# EAGLE schematic Arm_Board_2018 (EAGLE 8.4.1)

## Sheet 1 of 4: Tiva C TM4C1294NCPDT
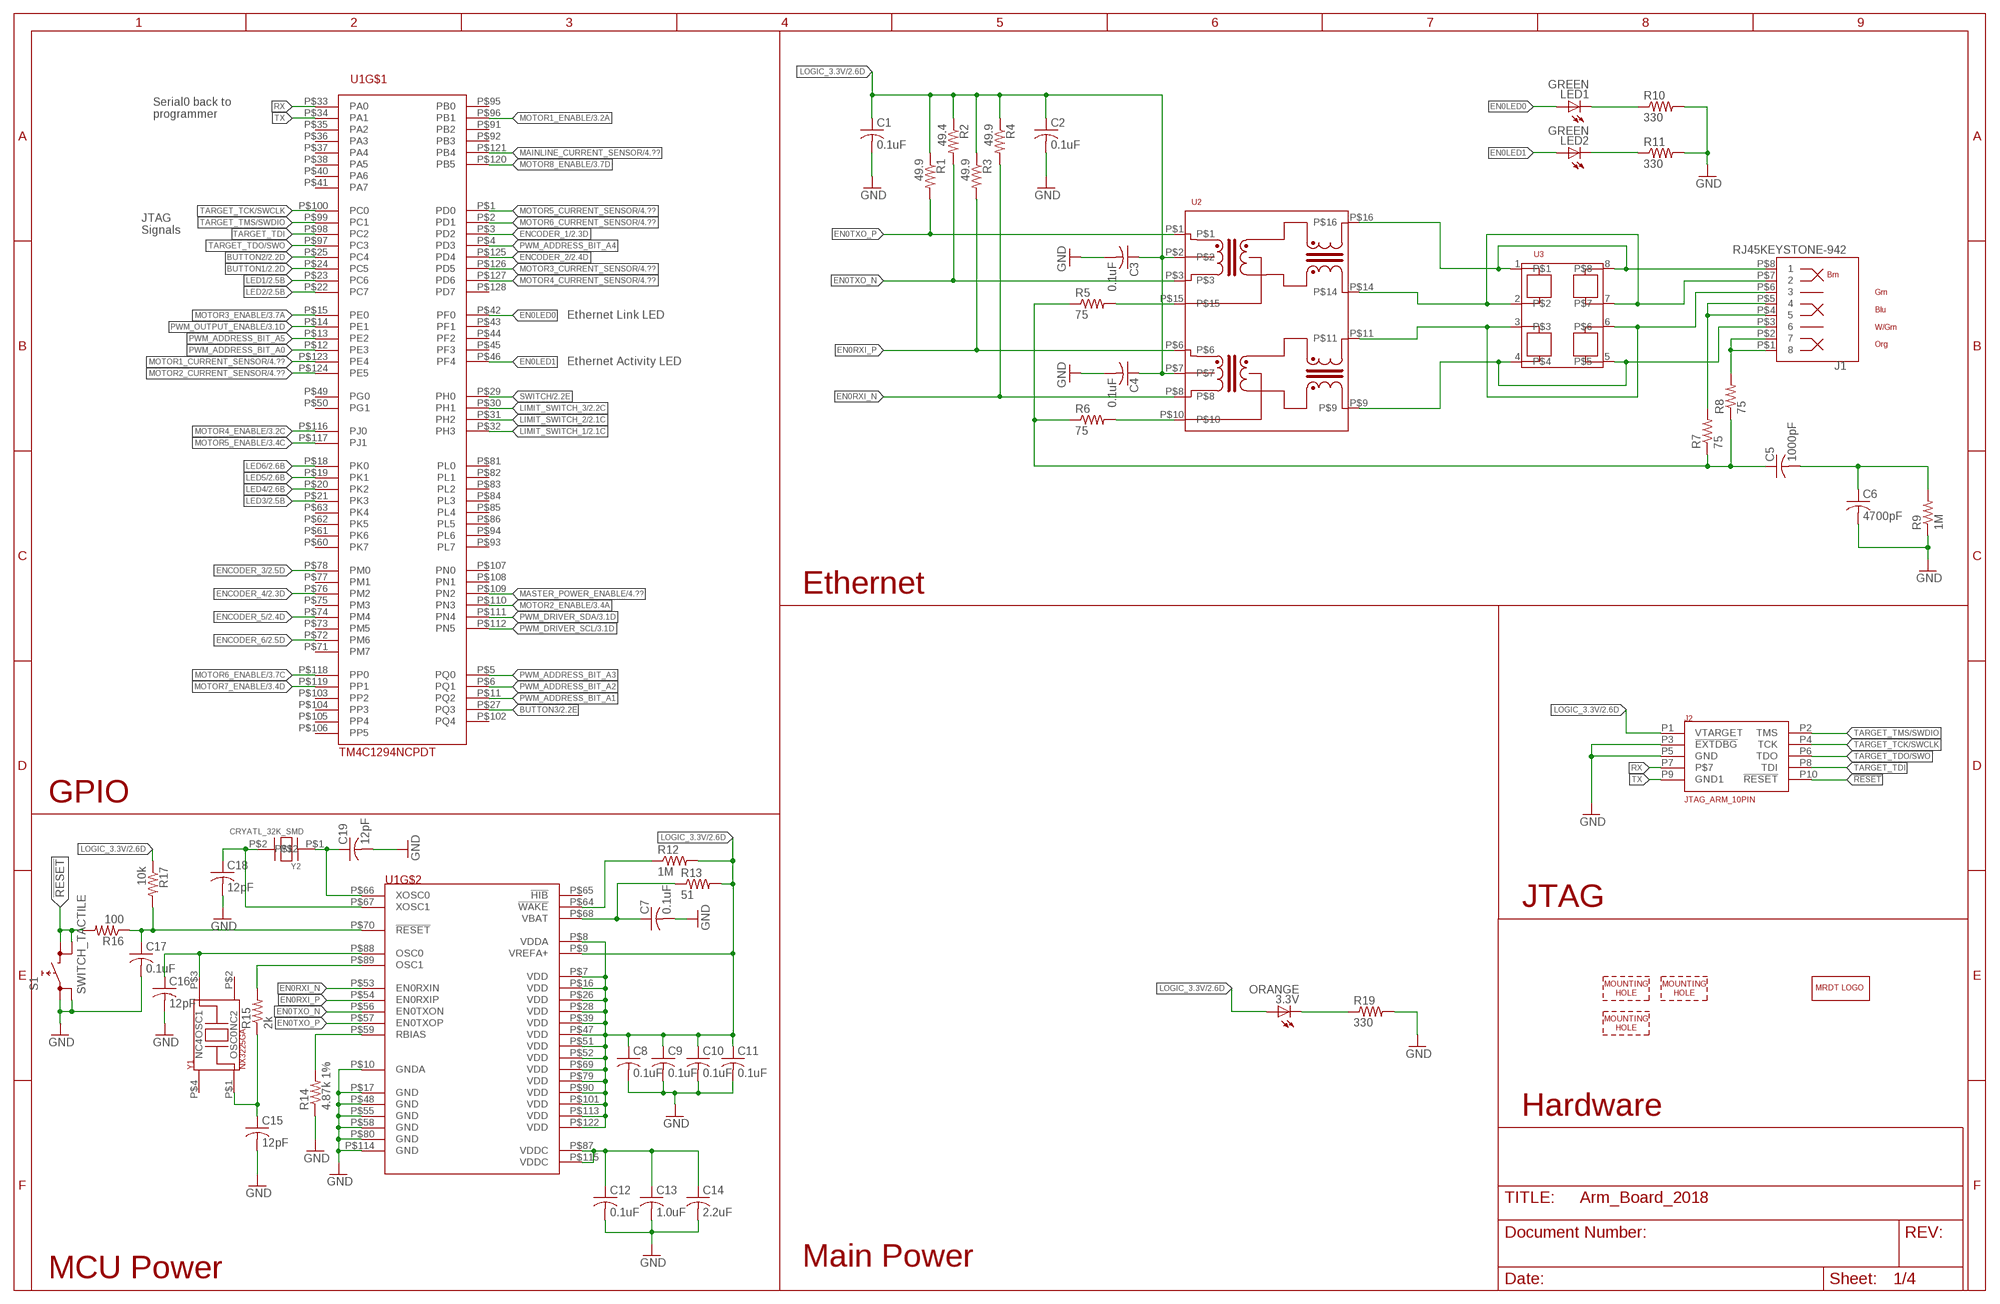
[diagram p0: schematic, sheet 1]

### Parts
3.3V  ORANGE  LEDCHIP-LED0603  [CHIP-LED0603]
C1  0.1uF  C-USC0603  [C0603]
C2  0.1uF  C-USC0603  [C0603]
C3  0.1uF  C-USC0603  [C0603]
C4  0.1uF  C-USC0603  [C0603]
C5  1000pF  C-USC0603  [C0603]
C6  4700pF  C-USC1206  [C1206]
C7  0.1uF  C-USC0603  [C0603]
C8  0.1uF  C-USC0603  [C0603]
C9  0.1uF  C-USC0603  [C0603]
C10  0.1uF  C-USC0603  [C0603]
C11  0.1uF  C-USC0603  [C0603]
C12  0.1uF  C-USC0603  [C0603]
C13  1.0uF  C-USC0603  [C0603]
C14  2.2uF  C-USC0603  [C0603]
C15  12pF  C-USC0603  [C0603]
C16  12pF  C-USC0603  [C0603]
C17  0.1uF  C-USC0603  [C0603]
C18  12pF  C-USC0603  [C0603]
C19  12pF  C-USC0603  [C0603]
J1  RJ45KEYSTONE-942  [KEYSTONE-942]
J2  JTAG_ARM_10PIN  [CON_2X5_50MIL]
LED1  GREEN  LEDCHIP-LED0603  [CHIP-LED0603]
LED2  GREEN  LEDCHIP-LED0603  [CHIP-LED0603]
R1  49.9  R-US_R0603  [R0603]
R2  49.4  R-US_R0603  [R0603]
R3  49.9  R-US_R0603  [R0603]
R4  49.9  R-US_R0603  [R0603]
R5  75  R-US_R0603  [R0603]
R6  75  R-US_R0603  [R0603]
R7  75  R-US_R0603  [R0603]
R8  75  R-US_R0603  [R0603]
R9  1M  R-US_R1206  [R1206]
R10  330  R-US_R0603  [R0603]
R11  330  R-US_R0603  [R0603]
R12  1M  R-US_R0603  [R0603]
R13  51  R-US_R0603  [R0603]
R14  4.87k 1%  R-US_R0603  [R0603]
R15  2k  R-US_R0603  [R0603]
R16  100  R-US_R0603  [R0603]
R17  10k  R-US_R0603  [R0603]
R19  330  R-US_R0603  [R0603]
S1  SWITCH_TACTILE  [SWITCH_6MM_6MM_TE_CON_SMD]
U1  TM4C1294NCPDT  [TQFP-128]
U2  HX1198FNL  [HX1198FNL]
U3  SLVU2.8-4  [SOIC8]
U$1  MRDT_LOGO  [MRDT_LOGO]
U$2  MOUNTING_HOLE#6  [#6_SCREW]
U$3  MOUNTING_HOLE#6  [#6_SCREW]
U$4  MOUNTING_HOLE#6  [#6_SCREW]
Y1  NX3225GA  [NDK3.2X2.5]
Y2  CRYATL_32K_SMD  [CRYSTAL_32K_SMD]

### Nets
!RESET: J2.P10(!RESET) R16.2 S1.P$3 S1.P$4
BUTTON1: U1.P$24(PC5) ; also sheet 2
BUTTON2: U1.P$25(PC4) ; also sheet 2
BUTTON3: U1.P$27(PQ3) ; also sheet 2
EN0LED0: LED1.A U1.P$42(PF0)
EN0LED1: LED2.A U1.P$46(PF4)
EN0RXI_N [Ethernet]: R4.2 U1.P$53(EN0RXIN) U2.P$8
EN0RXI_P [Ethernet]: R3.2 U1.P$54(EN0RXIP) U2.P$6
EN0TXO_N [Ethernet]: R2.2 U1.P$56(EN0TXON) U2.P$3
EN0TXO_P [Ethernet]: R1.2 U1.P$57(EN0TXOP) U2.P$1
ENCODER_1: U1.P$3(PD2) ; also sheet 2
ENCODER_2: U1.P$125(PD4) ; also sheet 2
ENCODER_3: U1.P$78(PM0) ; also sheet 2
ENCODER_4: U1.P$76(PM2) ; also sheet 2
ENCODER_5: U1.P$74(PM4) ; also sheet 2
ENCODER_6: U1.P$72(PM6) ; also sheet 2
GND: C1.2 C2.2 C3.2 C4.2 C6.2 C7.2 C8.2 C9.2 C10.2 C11.2 C12.2 C13.2 C14.2 C15.2 C16.2 C17.2 C18.2 C19.2 J2.P3(!EXTDBG) J2.P5(GND) R9.1 R10.2 R11.2 R14.1 R19.2 S1.P$1 S1.P$2 U1.P$10(GNDA) U1.P$17(GND) U1.P$48(GND) U1.P$55(GND) U1.P$58(GND) U1.P$80(GND) U1.P$114(GND) ; also sheet 2,3,4
LED1: U1.P$23(PC6) ; also sheet 2
LED2: U1.P$22(PC7) ; also sheet 2
LED3: U1.P$21(PK3) ; also sheet 2
LED4: U1.P$20(PK2) ; also sheet 2
LED5: U1.P$19(PK1) ; also sheet 2
LED6: U1.P$18(PK0) ; also sheet 2
LIMIT_SWITCH_1: U1.P$32(PH3) ; also sheet 2
LIMIT_SWITCH_2: U1.P$31(PH2) ; also sheet 2
LIMIT_SWITCH_3: U1.P$30(PH1) ; also sheet 2
LOGIC_3.3V: 3.3V.A C1.1 C2.1 C3.1 C4.1 C8.1 C9.1 C10.1 C11.1 J2.P1(VTARGET) R1.1 R2.1 R3.1 R4.1 R12.2 R13.2 R17.1 U1.P$7(VDD) U1.P$8(VDDA) U1.P$9(VREFA+) U1.P$16(VDD) U1.P$26(VDD) U1.P$28(VDD) U1.P$39(VDD) U1.P$47(VDD) U1.P$51(VDD) U1.P$52(VDD) U1.P$69(VDD) U1.P$79(VDD) U1.P$90(VDD) U1.P$101(VDD) U1.P$113(VDD) U1.P$122(VDD) U2.P$2 U2.P$7 ; also sheet 2,3,4
MAINLINE_CURRENT_SENSOR: U1.P$121(PB4) ; also sheet 4
MASTER_POWER_ENABLE: U1.P$109(PN2) ; also sheet 4
MOTOR1_CURRENT_SENSOR: U1.P$123(PE4) ; also sheet 4
MOTOR1_ENABLE: U1.P$96(PB1) ; also sheet 3
MOTOR2_CURRENT_SENSOR: U1.P$124(PE5) ; also sheet 4
MOTOR2_ENABLE: U1.P$110(PN3) ; also sheet 3
MOTOR3_CURRENT_SENSOR: U1.P$126(PD5) ; also sheet 4
MOTOR3_ENABLE: U1.P$15(PE0) ; also sheet 3
MOTOR4_CURRENT_SENSOR: U1.P$127(PD6) ; also sheet 4
MOTOR4_ENABLE: U1.P$116(PJ0) ; also sheet 3
MOTOR5_CURRENT_SENSOR: U1.P$1(PD0) ; also sheet 4
MOTOR5_ENABLE: U1.P$117(PJ1) ; also sheet 3
MOTOR6_CURRENT_SENSOR: U1.P$2(PD1) ; also sheet 4
MOTOR6_ENABLE: U1.P$118(PP0) ; also sheet 3
MOTOR7_ENABLE: U1.P$119(PP1) ; also sheet 3
MOTOR8_ENABLE: U1.P$120(PB5) ; also sheet 3
N_$1: R5.2 U2.P$15
N_$3: R6.2 U2.P$10
N_$4: J1.P$7 U2.P$14 U3.2 U3.7
N_$5: J1.P$6 U2.P$11 U3.3 U3.6
N_$6: J1.P$8 U2.P$16 U3.1 U3.8
N_$7: J1.P$3 U2.P$9 U3.4 U3.5
N_$8: LED2.C R11.1
N_$9: LED1.C R10.1
N_$10: C7.1 R13.1 U1.P$68(VBAT)
N_$11: J1.P$4 J1.P$5 R7.2
N_$12: R12.1 U1.P$64(!WAKE)
N_$13: J1.P$1 J1.P$2 R8.2
N_$14: C5.1 R5.1 R6.1 R7.1 R8.1
N_$15: C5.2 C6.1 R9.2
N_$16: C12.1 C13.1 C14.1 U1.P$87(VDDC) U1.P$115(VDDC)
N_$17: R15.2 U1.P$89(OSC1)
N_$18: C16.1 U1.P$88(OSC0) Y1.P$3(OSC1)
N_$19: R14.2 U1.P$59(RBIAS)
N_$20: C17.1 R16.1 R17.2 U1.P$70(!RESET)
N_$21: C15.1 R15.1 Y1.P$1(OSC0)
N_$22: C18.1 U1.P$67(XOSC1) Y2.P$2
N_$23: C19.1 U1.P$66(XOSC0) Y2.P$1
N_$26: 3.3V.C R19.1
PWM_ADDRESS_BIT_A0: U1.P$12(PE3)
PWM_ADDRESS_BIT_A1: U1.P$11(PQ2)
PWM_ADDRESS_BIT_A2: U1.P$6(PQ1)
PWM_ADDRESS_BIT_A3: U1.P$5(PQ0)
PWM_ADDRESS_BIT_A4: U1.P$4(PD3)
PWM_ADDRESS_BIT_A5: U1.P$13(PE2)
PWM_DRIVER_SCL: U1.P$112(PN5) ; also sheet 3
PWM_DRIVER_SDA: U1.P$111(PN4) ; also sheet 3
PWM_OUTPUT_ENABLE: U1.P$14(PE1) ; also sheet 3
RX: J2.P7 U1.P$33(PA0)
SWITCH: U1.P$29(PH0) ; also sheet 2
TARGET_TCK/SWCLK: J2.P4(TCK) U1.P$100(PC0)
TARGET_TDI: J2.P8(TDI) U1.P$98(PC2)
TARGET_TDO/SWO: J2.P6(TDO) U1.P$97(PC3)
TARGET_TMS/SWDIO: J2.P2(TMS) U1.P$99(PC1)
TX: J2.P9(GND1) U1.P$34(PA1)
Unconnected: U1.P$35(PA2) U1.P$36(PA3) U1.P$37(PA4) U1.P$38(PA5) U1.P$40(PA6) U1.P$41(PA7) U1.P$43(PF1) U1.P$44(PF2) U1.P$45(PF3) U1.P$49(PG0) U1.P$50(PG1) U1.P$60(PK7) U1.P$61(PK6) U1.P$62(PK5) U1.P$63(PK4) U1.P$65(!HIB) U1.P$71(PM7) U1.P$73(PM5) U1.P$75(PM3) U1.P$77(PM1) U1.P$81(PL0) U1.P$82(PL1) U1.P$83(PL2) U1.P$84(PL3) U1.P$85(PL4) U1.P$86(PL5) U1.P$91(PB2) U1.P$92(PB3) U1.P$93(PL7) U1.P$94(PL6) U1.P$95(PB0) U1.P$102(PQ4) U1.P$103(PP2) U1.P$104(PP3) U1.P$105(PP4) U1.P$106(PP5) U1.P$107(PN0) U1.P$108(PN1) U1.P$128(PD7) Y1.P$2(NC2) Y1.P$4(NC4)

### Notes on the sheet
- Serial0 back to
  programmer
- JTAG
  Signals
- Ethernet Link LED
- Ethernet Activity LED
- Ethernet
- GPIO
- JTAG
- Hardware
- Main Power
- MCU Power

## Sheet 2 of 4: I/O
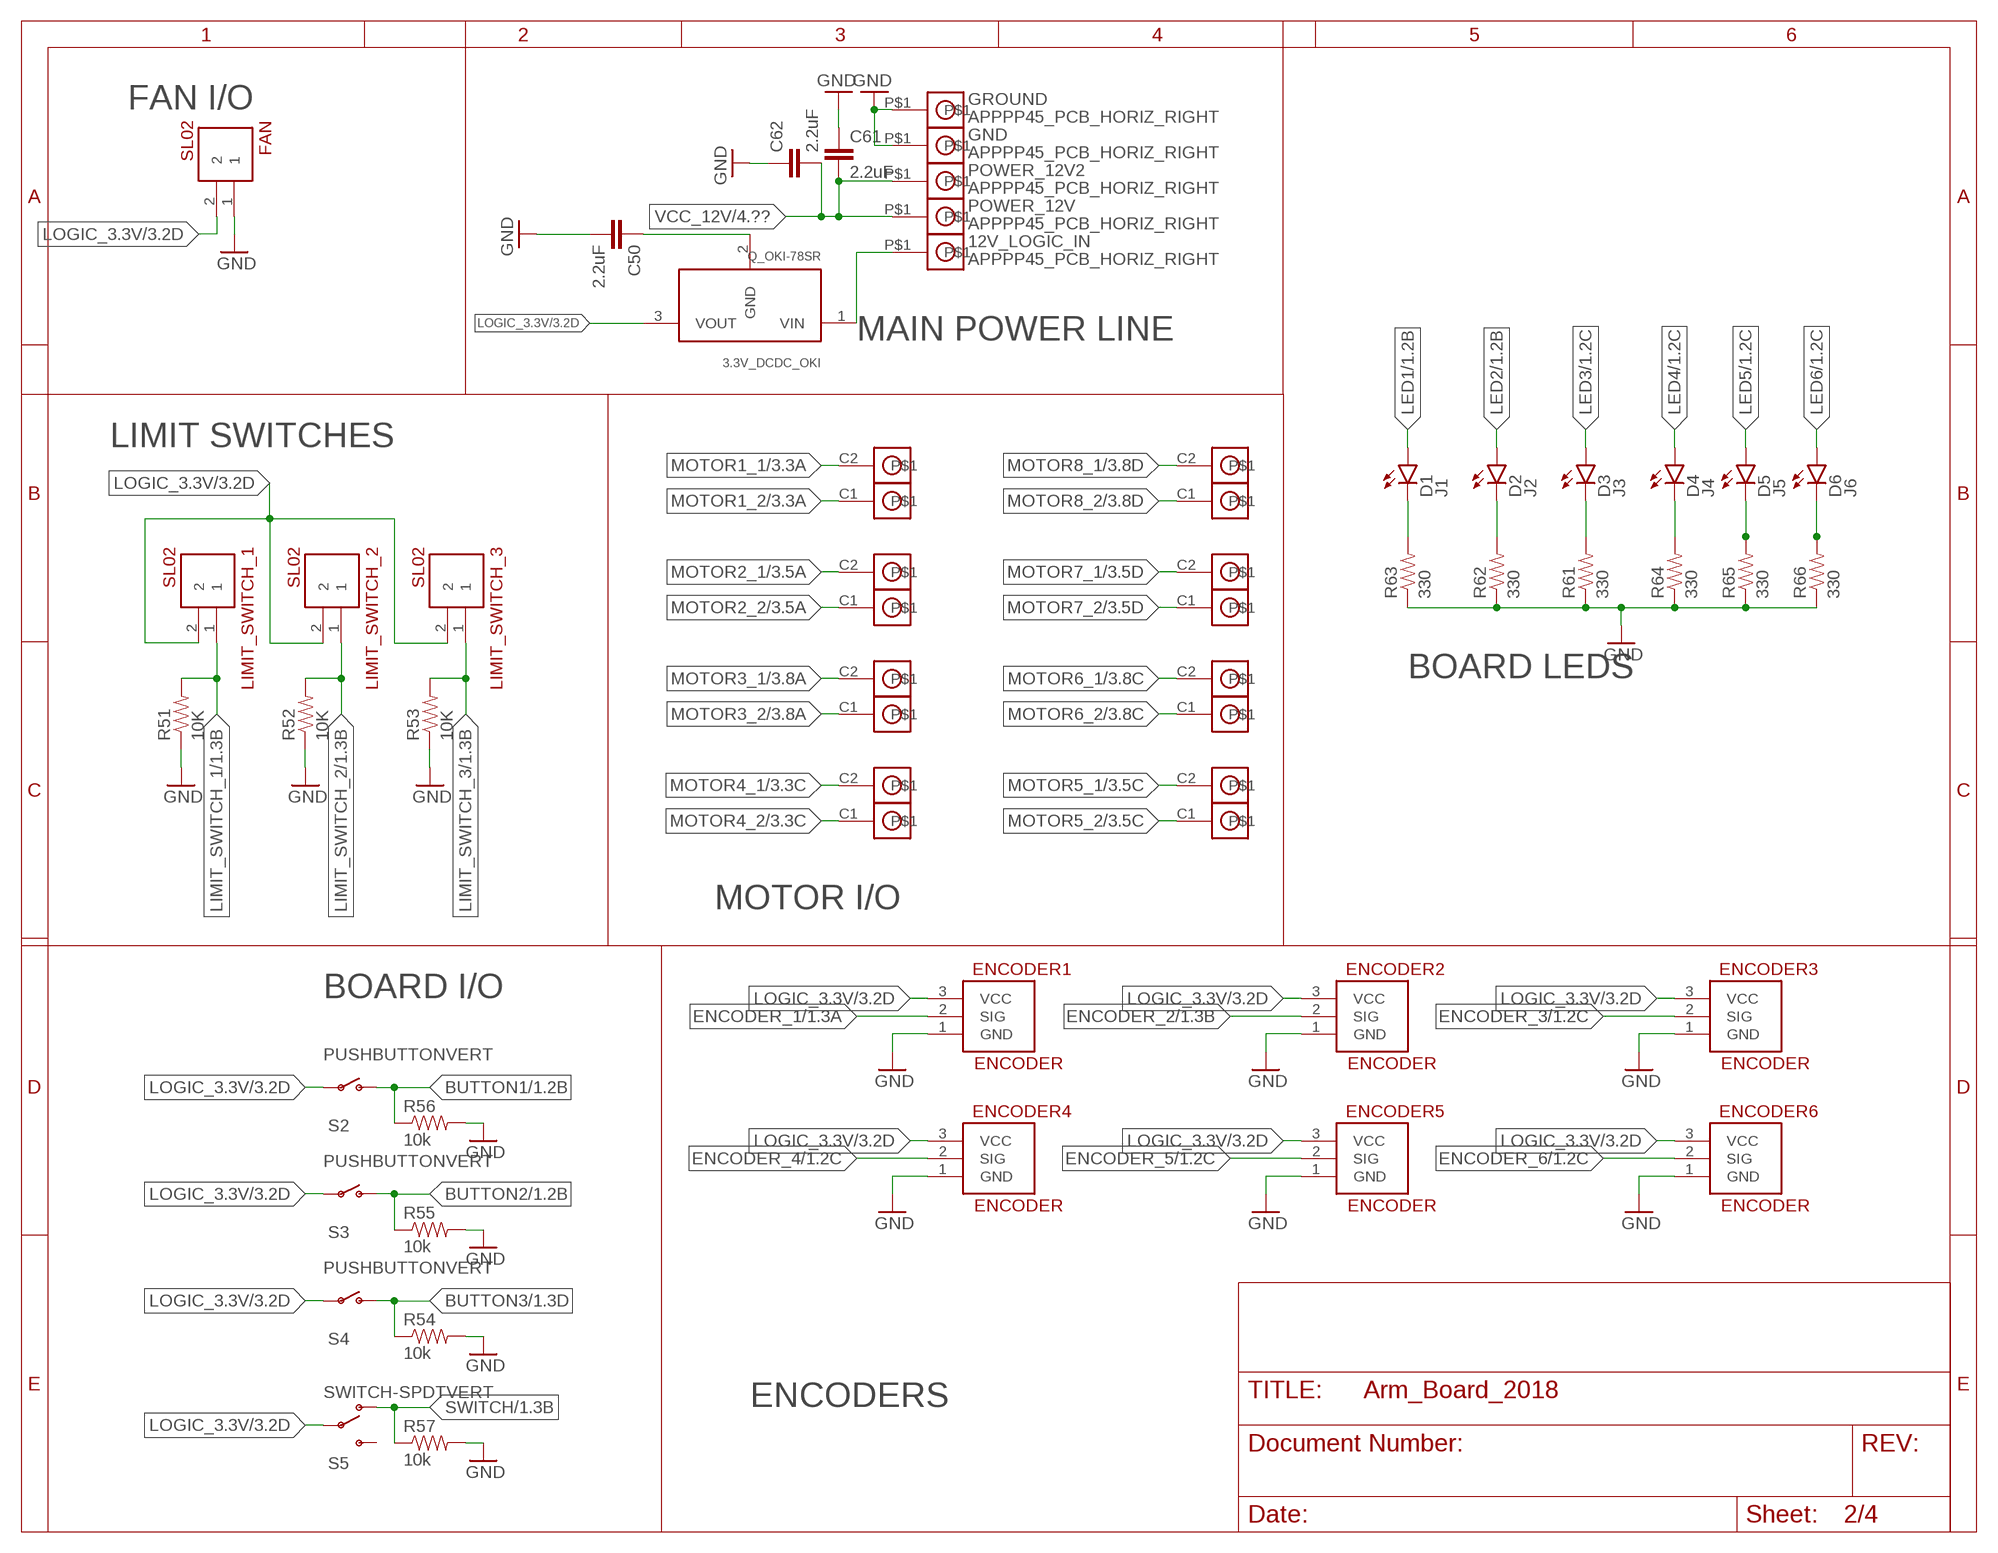
[diagram p1: schematic, sheet 2]

### Parts
3.3V_DCDC_OKI  Q_OKI-78SR  [Q_OKI-78SR]
12V_LOGIC_IN  APPPP45_PCB_HORIZ_RIGHT  [APP45_PCB_HORIZ_RIGHT]
C50  2.2uF  CAP0603-CAP  [0603-CAP]
C61  2.2uF  CAP1206  [1206]
C62  2.2uF  CAP1206  [1206]
D1  J1  LED0603  [LED-0603]
D2  J2  LED0603  [LED-0603]
D3  J3  LED0603  [LED-0603]
D4  J4  LED0603  [LED-0603]
D5  J5  LED0603  [LED-0603]
D6  J6  LED0603  [LED-0603]
ENCODER1  ENCODER  [MOLEX-70543-0002]
ENCODER2  ENCODER  [MOLEX-70543-0002]
ENCODER3  ENCODER  [MOLEX-70543-0002]
ENCODER4  ENCODER  [MOLEX-70543-0002]
ENCODER5  ENCODER  [MOLEX-70543-0002]
ENCODER6  ENCODER  [MOLEX-70543-0002]
FAN  SL02  [MOLEX-70543-0001]
GND  APPPP45_PCB_HORIZ_RIGHT  [APP45_PCB_HORIZ_RIGHT]
GROUND  APPPP45_PCB_HORIZ_RIGHT  [APP45_PCB_HORIZ_RIGHT]
LIMIT_SWITCH_1  SL02  [MOLEX-70543-0001]
LIMIT_SWITCH_2  SL02  [MOLEX-70543-0001]
LIMIT_SWITCH_3  SL02  [MOLEX-70543-0001]
MOTOR1  APP_2POS_CONFIGGENERAL_CONFIG  [APP45_HORIZ_CONFIG]
MOTOR2  APP_2POS_CONFIGGENERAL_CONFIG  [APP45_HORIZ_CONFIG]
MOTOR3  APP_2POS_CONFIGGENERAL_CONFIG  [APP45_HORIZ_CONFIG]
MOTOR4  APP_2POS_CONFIGGENERAL_CONFIG  [APP45_HORIZ_CONFIG]
MOTOR5  APP_2POS_CONFIGGENERAL_CONFIG  [APP45_HORIZ_CONFIG]
MOTOR6  APP_2POS_CONFIGGENERAL_CONFIG  [APP45_HORIZ_CONFIG]
MOTOR7  APP_2POS_CONFIGGENERAL_CONFIG  [APP45_HORIZ_CONFIG]
MOTOR8  APP_2POS_CONFIGGENERAL_CONFIG  [APP45_HORIZ_CONFIG]
POWER_12V  APPPP45_PCB_HORIZ_RIGHT  [APP45_PCB_HORIZ_RIGHT]
POWER_12V2  APPPP45_PCB_HORIZ_RIGHT  [APP45_PCB_HORIZ_RIGHT]
R51  10K  RESISTOR0402-RES  [0402-RES]
R52  10K  RESISTOR0402-RES  [0402-RES]
R53  10K  RESISTOR0402-RES  [0402-RES]
R54  10k  RESISTOR0402-RES  [0402-RES]
R55  10k  RESISTOR0402-RES  [0402-RES]
R56  10k  RESISTOR0402-RES  [0402-RES]
R57  10k  RESISTOR0402-RES  [0402-RES]
R61  330  RESISTOR0402-RES  [0402-RES]
R62  330  RESISTOR0402-RES  [0402-RES]
R63  330  RESISTOR0402-RES  [0402-RES]
R64  330  RESISTOR0402-RES  [0402-RES]
R65  330  RESISTOR0402-RES  [0402-RES]
R66  330  RESISTOR0402-RES  [0402-RES]
S2  PUSHBUTTONVERT  [APEM-MJTP1243]
S3  PUSHBUTTONVERT  [APEM-MJTP1243]
S4  PUSHBUTTONVERT  [APEM-MJTP1243]
S5  SWITCH-SPDTVERT  [C&K-SS12D07VG4NSGAPA]

### Nets
BUTTON1: R56.1 S2.P$2(S) ; also sheet 1
BUTTON2: R55.1 S3.P$2(S) ; also sheet 1
BUTTON3: R54.1 S4.P$2(S) ; also sheet 1
ENCODER_1: ENCODER1.2(SIG) ; also sheet 1
ENCODER_2: ENCODER2.2(SIG) ; also sheet 1
ENCODER_3: ENCODER3.2(SIG) ; also sheet 1
ENCODER_4: ENCODER4.2(SIG) ; also sheet 1
ENCODER_5: ENCODER5.2(SIG) ; also sheet 1
ENCODER_6: ENCODER6.2(SIG) ; also sheet 1
GND: C50.2 C61.1 C62.1 ENCODER1.1(GND) ENCODER2.1(GND) ENCODER3.1(GND) ENCODER4.1(GND) ENCODER5.1(GND) ENCODER6.1(GND) FAN.1 GND.P$1 GROUND.P$1 R51.1 R52.1 R53.1 R54.2 R55.2 R56.2 R57.2 R61.1 R62.1 R63.1 R64.1 R65.1 R66.1 ; also sheet 1,3,4
LED1: D1.A ; also sheet 1
LED2: D2.A ; also sheet 1
LED3: D3.A ; also sheet 1
LED4: D4.A ; also sheet 1
LED5: D5.A ; also sheet 1
LED6: D6.A ; also sheet 1
LIMIT_SWITCH_1: LIMIT_SWITCH_1.1 R51.2 ; also sheet 1
LIMIT_SWITCH_2: LIMIT_SWITCH_2.1 R52.2 ; also sheet 1
LIMIT_SWITCH_3: LIMIT_SWITCH_3.1 R53.2 ; also sheet 1
LOGIC_3.3V: 3.3V_DCDC_OKI.3(VOUT) ENCODER1.3(VCC) ENCODER2.3(VCC) ENCODER3.3(VCC) ENCODER4.3(VCC) ENCODER5.3(VCC) ENCODER6.3(VCC) FAN.2 LIMIT_SWITCH_1.2 LIMIT_SWITCH_2.2 LIMIT_SWITCH_3.2 S2.P$1(P) S3.P$1(P) S4.P$1(P) S5.P$2(P) ; also sheet 1,3,4
MOTOR1_1 [Power Trace]: MOTOR1.C2 ; also sheet 3
MOTOR1_2 [Power Trace]: MOTOR1.C1 ; also sheet 3
MOTOR2_1 [Power Trace]: MOTOR2.C2 ; also sheet 3
MOTOR2_2 [Power Trace]: MOTOR2.C1 ; also sheet 3
MOTOR3_1 [Power Trace]: MOTOR3.C2 ; also sheet 3
MOTOR3_2 [Power Trace]: MOTOR3.C1 ; also sheet 3
MOTOR4_1: MOTOR4.C2 ; also sheet 3
MOTOR4_2 [Power Trace]: MOTOR4.C1 ; also sheet 3
MOTOR5_1 [Power Trace]: MOTOR5.C2 ; also sheet 3
MOTOR5_2 [Power Trace]: MOTOR5.C1 ; also sheet 3
MOTOR6_1 [Power Trace]: MOTOR6.C2 ; also sheet 3
MOTOR6_2 [Power Trace]: MOTOR6.C1 ; also sheet 3
MOTOR7_1 [Power Trace]: MOTOR7.C2 ; also sheet 3
MOTOR7_2 [Power Trace]: MOTOR7.C1 ; also sheet 3
MOTOR8_1 [Power Trace]: MOTOR8.C2 ; also sheet 3
MOTOR8_2 [Power Trace]: MOTOR8.C1 ; also sheet 3
N$1: 3.3V_DCDC_OKI.2(GND) C50.1
N$8: 3.3V_DCDC_OKI.1(VIN) 12V_LOGIC_IN.P$1
N$68: D1.C R63.2
N$69: D2.C R62.2
N$77: D6.C R66.2
N$79: D3.C R61.2
N$80: D4.C R64.2
N$81: D5.C R65.2
SWITCH: R57.1 S5.P$3(O) ; also sheet 1
VCC_12V: C61.2 C62.2 POWER_12V2.P$1 POWER_12V.P$1 ; also sheet 4
Unconnected: S5.P$1(S)

### Notes on the sheet
- FAN I/O
- MAIN POWER LINE
- LIMIT SWITCHES
- BOARD LEDS
- MOTOR I/O
- BOARD I/O
- ENCODERS

## Sheet 3 of 4: H-Bridges
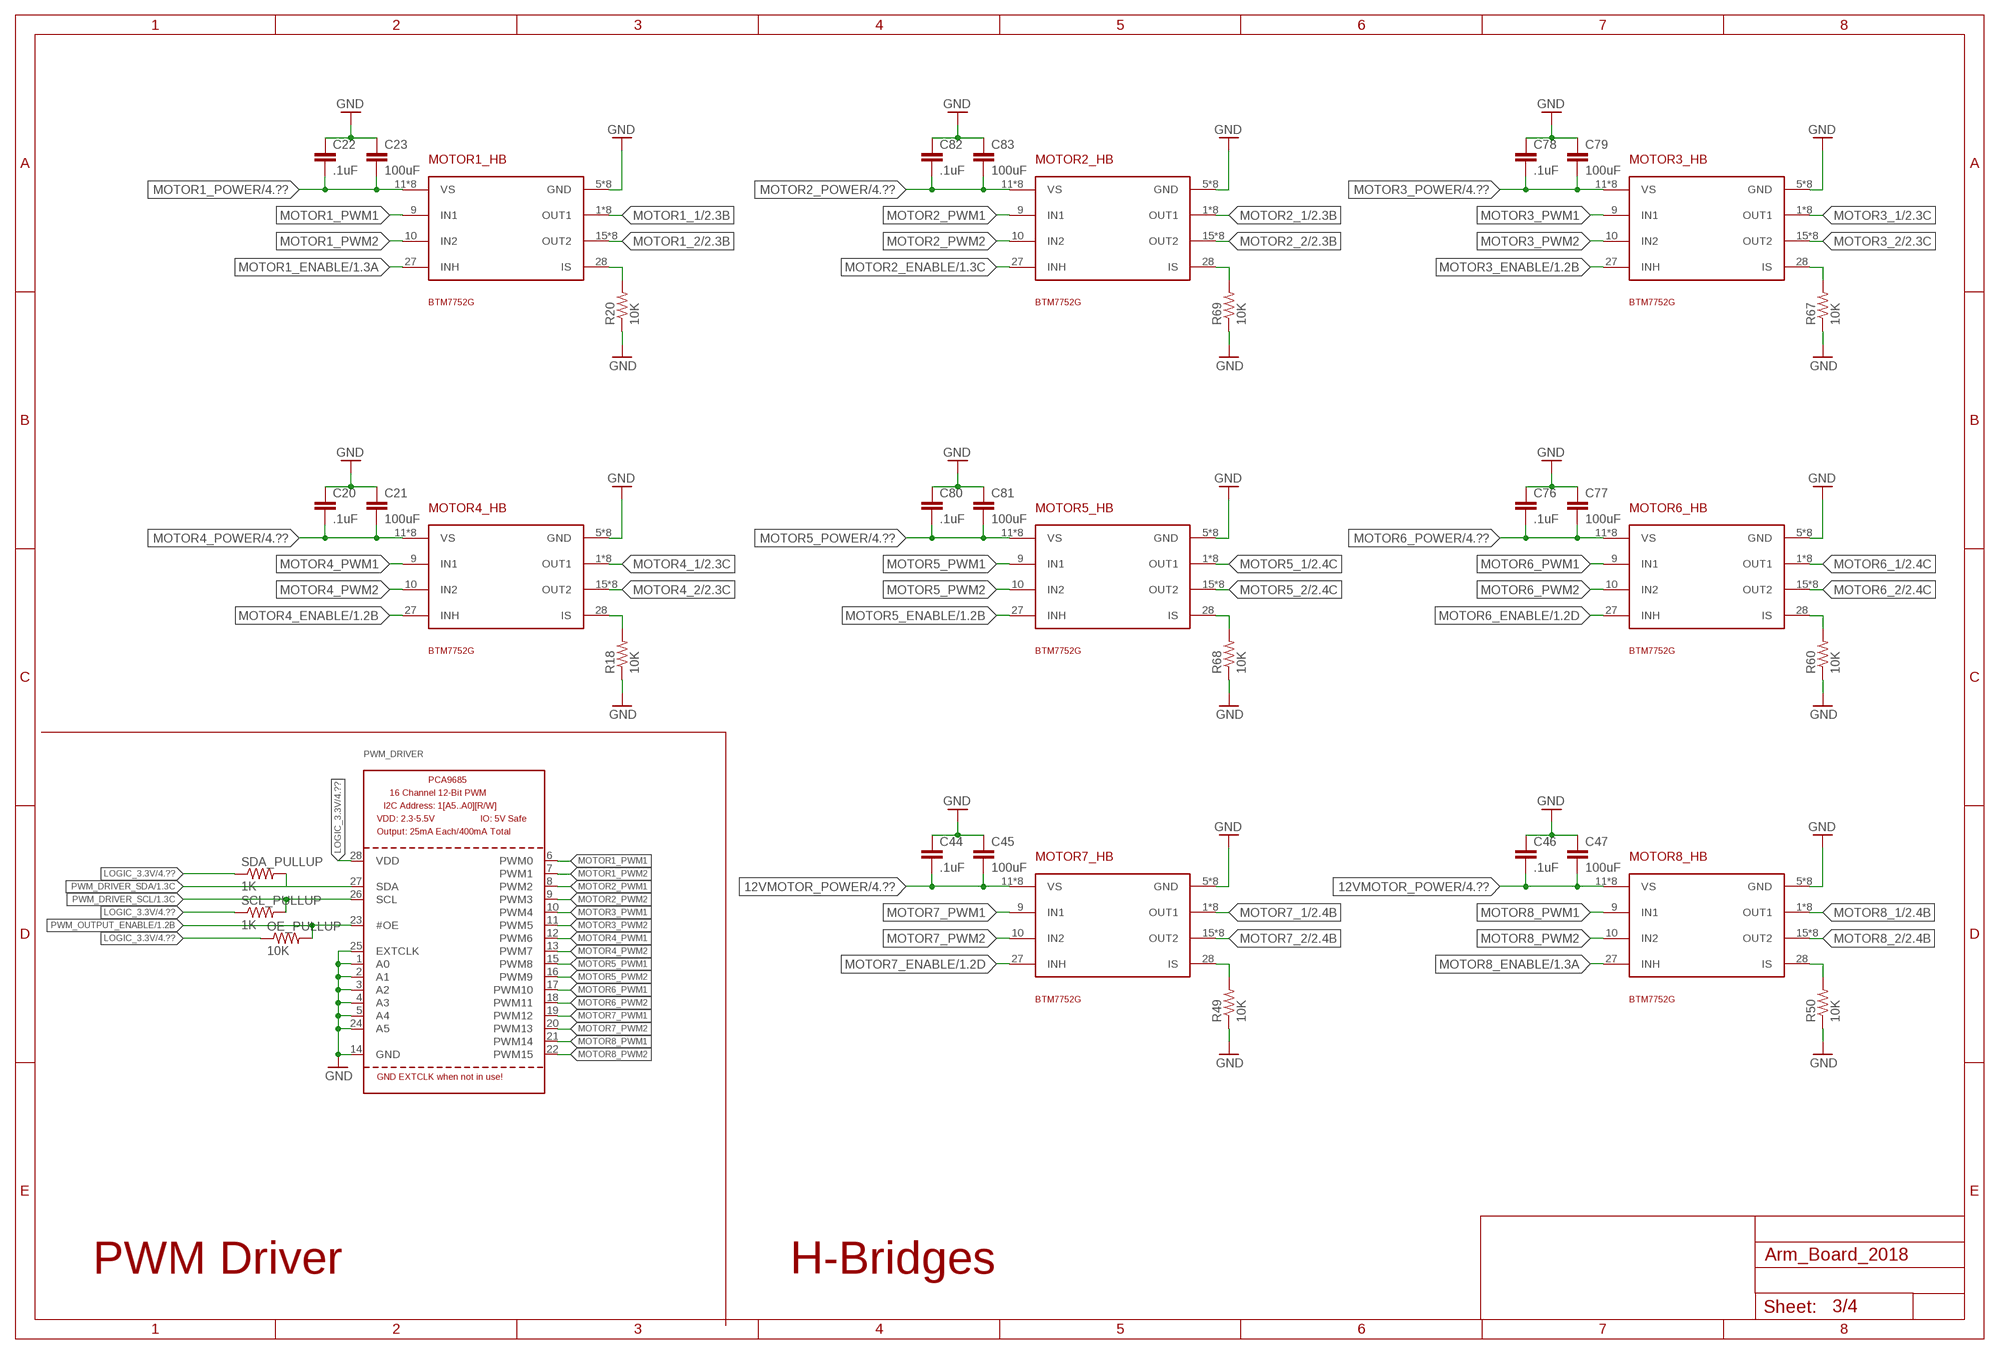
[diagram p2: schematic, sheet 3]

### Parts
C20  .1uF  CAP0603-CAP  [0603-CAP]
C21  100uF  CAP1210  [1210]
C22  .1uF  CAP0603-CAP  [0603-CAP]
C23  100uF  CAP1210  [1210]
C44  .1uF  CAP0603-CAP  [0603-CAP]
C45  100uF  CAP1210  [1210]
C46  .1uF  CAP0603-CAP  [0603-CAP]
C47  100uF  CAP1210  [1210]
C76  .1uF  CAP0603-CAP  [0603-CAP]
C77  100uF  CAP1210  [1210]
C78  .1uF  CAP0603-CAP  [0603-CAP]
C79  100uF  CAP1210  [1210]
C80  .1uF  CAP0603-CAP  [0603-CAP]
C81  100uF  CAP1210  [1210]
C82  .1uF  CAP0603-CAP  [0603-CAP]
C83  100uF  CAP1210  [1210]
MOTOR1_HB  BTM7752G  [36-BSSOP]
MOTOR2_HB  BTM7752G  [36-BSSOP]
MOTOR3_HB  BTM7752G  [36-BSSOP]
MOTOR4_HB  BTM7752G  [36-BSSOP]
MOTOR5_HB  BTM7752G  [36-BSSOP]
MOTOR6_HB  BTM7752G  [36-BSSOP]
MOTOR7_HB  BTM7752G  [36-BSSOP]
MOTOR8_HB  BTM7752G  [36-BSSOP]
OE_PULLUP  10K  RESISTOR0402-RES  [0402-RES]
PWM_DRIVER  PCA9685  [TSSOP28]
R18  10K  RESISTOR0402-RES  [0402-RES]
R20  10K  RESISTOR0402-RES  [0402-RES]
R49  10K  RESISTOR0402-RES  [0402-RES]
R50  10K  RESISTOR0402-RES  [0402-RES]
R60  10K  RESISTOR0402-RES  [0402-RES]
R67  10K  RESISTOR0402-RES  [0402-RES]
R68  10K  RESISTOR0402-RES  [0402-RES]
R69  10K  RESISTOR0402-RES  [0402-RES]
SCL_PULLUP  1K  RESISTOR0402-RES  [0402-RES]
SDA_PULLUP  1K  RESISTOR0402-RES  [0402-RES]

### Nets
12VMOTOR_POWER [Power Trace]: C44.2 C45.2 C46.2 C47.2 MOTOR7_HB.11(VS) MOTOR7_HB.12(VS) MOTOR7_HB.13(VS) MOTOR7_HB.14(VS) MOTOR7_HB.29(VS) MOTOR7_HB.30(VS) MOTOR7_HB.31(VS) MOTOR7_HB.32(VS) MOTOR8_HB.11(VS) MOTOR8_HB.12(VS) MOTOR8_HB.13(VS) MOTOR8_HB.14(VS) MOTOR8_HB.29(VS) MOTOR8_HB.30(VS) MOTOR8_HB.31(VS) MOTOR8_HB.32(VS) ; also sheet 4
GND: C20.1 C21.1 C22.1 C23.1 C44.1 C45.1 C46.1 C47.1 C76.1 C77.1 C78.1 C79.1 C80.1 C81.1 C82.1 C83.1 MOTOR1_HB.5(GND) MOTOR1_HB.6(GND) MOTOR1_HB.7(GND) MOTOR1_HB.8(GND) MOTOR1_HB.23(GND) MOTOR1_HB.24(GND) MOTOR1_HB.25(GND) MOTOR1_HB.26(GND) MOTOR2_HB.5(GND) MOTOR2_HB.6(GND) MOTOR2_HB.7(GND) MOTOR2_HB.8(GND) MOTOR2_HB.23(GND) MOTOR2_HB.24(GND) MOTOR2_HB.25(GND) MOTOR2_HB.26(GND) MOTOR3_HB.5(GND) MOTOR3_HB.6(GND) MOTOR3_HB.7(GND) MOTOR3_HB.8(GND) MOTOR3_HB.23(GND) MOTOR3_HB.24(GND) MOTOR3_HB.25(GND) MOTOR3_HB.26(GND) MOTOR4_HB.5(GND) MOTOR4_HB.6(GND) MOTOR4_HB.7(GND) MOTOR4_HB.8(GND) MOTOR4_HB.23(GND) MOTOR4_HB.24(GND) MOTOR4_HB.25(GND) MOTOR4_HB.26(GND) MOTOR5_HB.5(GND) MOTOR5_HB.6(GND) MOTOR5_HB.7(GND) MOTOR5_HB.8(GND) MOTOR5_HB.23(GND) MOTOR5_HB.24(GND) MOTOR5_HB.25(GND) MOTOR5_HB.26(GND) MOTOR6_HB.5(GND) MOTOR6_HB.6(GND) MOTOR6_HB.7(GND) MOTOR6_HB.8(GND) MOTOR6_HB.23(GND) MOTOR6_HB.24(GND) MOTOR6_HB.25(GND) MOTOR6_HB.26(GND) MOTOR7_HB.5(GND) MOTOR7_HB.6(GND) MOTOR7_HB.7(GND) MOTOR7_HB.8(GND) MOTOR7_HB.23(GND) MOTOR7_HB.24(GND) MOTOR7_HB.25(GND) MOTOR7_HB.26(GND) MOTOR8_HB.5(GND) MOTOR8_HB.6(GND) MOTOR8_HB.7(GND) MOTOR8_HB.8(GND) MOTOR8_HB.23(GND) MOTOR8_HB.24(GND) MOTOR8_HB.25(GND) MOTOR8_HB.26(GND) PWM_DRIVER.1(A0) PWM_DRIVER.2(A1) PWM_DRIVER.3(A2) PWM_DRIVER.4(A3) PWM_DRIVER.5(A4) PWM_DRIVER.14(GND) PWM_DRIVER.24(A5) PWM_DRIVER.25(EXTCLK) R18.1 R20.1 R49.1 R50.1 R60.1 R67.1 R68.1 R69.1 ; also sheet 1,2,4
LOGIC_3.3V: OE_PULLUP.1 PWM_DRIVER.28(VDD) SCL_PULLUP.1 SDA_PULLUP.1 ; also sheet 1,2,4
MOTOR1_1 [Power Trace]: MOTOR1_HB.1(OUT1) MOTOR1_HB.2(OUT1) MOTOR1_HB.3(OUT1) MOTOR1_HB.4(OUT1) MOTOR1_HB.33(OUT1) MOTOR1_HB.34(OUT1) MOTOR1_HB.35(OUT1) MOTOR1_HB.36(OUT1) ; also sheet 2
MOTOR1_2 [Power Trace]: MOTOR1_HB.15(OUT2) MOTOR1_HB.16(OUT2) MOTOR1_HB.17(OUT2) MOTOR1_HB.18(OUT2) MOTOR1_HB.19(OUT2) MOTOR1_HB.20(OUT2) MOTOR1_HB.21(OUT2) MOTOR1_HB.22(OUT2) ; also sheet 2
MOTOR1_ENABLE: MOTOR1_HB.27(INH) ; also sheet 1
MOTOR1_POWER [Power Trace]: C22.2 C23.2 MOTOR1_HB.11(VS) MOTOR1_HB.12(VS) MOTOR1_HB.13(VS) MOTOR1_HB.14(VS) MOTOR1_HB.29(VS) MOTOR1_HB.30(VS) MOTOR1_HB.31(VS) MOTOR1_HB.32(VS) ; also sheet 4
MOTOR1_PWM1: MOTOR1_HB.9(IN1) PWM_DRIVER.6(PWM0)
MOTOR1_PWM2: MOTOR1_HB.10(IN2) PWM_DRIVER.7(PWM1)
MOTOR2_1 [Power Trace]: MOTOR2_HB.1(OUT1) MOTOR2_HB.2(OUT1) MOTOR2_HB.3(OUT1) MOTOR2_HB.4(OUT1) MOTOR2_HB.33(OUT1) MOTOR2_HB.34(OUT1) MOTOR2_HB.35(OUT1) MOTOR2_HB.36(OUT1) ; also sheet 2
MOTOR2_2 [Power Trace]: MOTOR2_HB.15(OUT2) MOTOR2_HB.16(OUT2) MOTOR2_HB.17(OUT2) MOTOR2_HB.18(OUT2) MOTOR2_HB.19(OUT2) MOTOR2_HB.20(OUT2) MOTOR2_HB.21(OUT2) MOTOR2_HB.22(OUT2) ; also sheet 2
MOTOR2_ENABLE: MOTOR2_HB.27(INH) ; also sheet 1
MOTOR2_POWER [Power Trace]: C82.2 C83.2 MOTOR2_HB.11(VS) MOTOR2_HB.12(VS) MOTOR2_HB.13(VS) MOTOR2_HB.14(VS) MOTOR2_HB.29(VS) MOTOR2_HB.30(VS) MOTOR2_HB.31(VS) MOTOR2_HB.32(VS) ; also sheet 4
MOTOR2_PWM1: MOTOR2_HB.9(IN1) PWM_DRIVER.8(PWM2)
MOTOR2_PWM2: MOTOR2_HB.10(IN2) PWM_DRIVER.9(PWM3)
MOTOR3_1 [Power Trace]: MOTOR3_HB.1(OUT1) MOTOR3_HB.2(OUT1) MOTOR3_HB.3(OUT1) MOTOR3_HB.4(OUT1) MOTOR3_HB.33(OUT1) MOTOR3_HB.34(OUT1) MOTOR3_HB.35(OUT1) MOTOR3_HB.36(OUT1) ; also sheet 2
MOTOR3_2 [Power Trace]: MOTOR3_HB.15(OUT2) MOTOR3_HB.16(OUT2) MOTOR3_HB.17(OUT2) MOTOR3_HB.18(OUT2) MOTOR3_HB.19(OUT2) MOTOR3_HB.20(OUT2) MOTOR3_HB.21(OUT2) MOTOR3_HB.22(OUT2) ; also sheet 2
MOTOR3_ENABLE: MOTOR3_HB.27(INH) ; also sheet 1
MOTOR3_POWER [Power Trace]: C78.2 C79.2 MOTOR3_HB.11(VS) MOTOR3_HB.12(VS) MOTOR3_HB.13(VS) MOTOR3_HB.14(VS) MOTOR3_HB.29(VS) MOTOR3_HB.30(VS) MOTOR3_HB.31(VS) MOTOR3_HB.32(VS) ; also sheet 4
MOTOR3_PWM1: MOTOR3_HB.9(IN1) PWM_DRIVER.10(PWM4)
MOTOR3_PWM2: MOTOR3_HB.10(IN2) PWM_DRIVER.11(PWM5)
MOTOR4_1: MOTOR4_HB.1(OUT1) MOTOR4_HB.2(OUT1) MOTOR4_HB.3(OUT1) MOTOR4_HB.4(OUT1) MOTOR4_HB.33(OUT1) MOTOR4_HB.34(OUT1) MOTOR4_HB.35(OUT1) MOTOR4_HB.36(OUT1) ; also sheet 2
MOTOR4_2 [Power Trace]: MOTOR4_HB.15(OUT2) MOTOR4_HB.16(OUT2) MOTOR4_HB.17(OUT2) MOTOR4_HB.18(OUT2) MOTOR4_HB.19(OUT2) MOTOR4_HB.20(OUT2) MOTOR4_HB.21(OUT2) MOTOR4_HB.22(OUT2) ; also sheet 2
MOTOR4_ENABLE: MOTOR4_HB.27(INH) ; also sheet 1
MOTOR4_POWER [Power Trace]: C20.2 C21.2 MOTOR4_HB.11(VS) MOTOR4_HB.12(VS) MOTOR4_HB.13(VS) MOTOR4_HB.14(VS) MOTOR4_HB.29(VS) MOTOR4_HB.30(VS) MOTOR4_HB.31(VS) MOTOR4_HB.32(VS) ; also sheet 4
MOTOR4_PWM1: MOTOR4_HB.9(IN1) PWM_DRIVER.12(PWM6)
MOTOR4_PWM2: MOTOR4_HB.10(IN2) PWM_DRIVER.13(PWM7)
MOTOR5_1 [Power Trace]: MOTOR5_HB.1(OUT1) MOTOR5_HB.2(OUT1) MOTOR5_HB.3(OUT1) MOTOR5_HB.4(OUT1) MOTOR5_HB.33(OUT1) MOTOR5_HB.34(OUT1) MOTOR5_HB.35(OUT1) MOTOR5_HB.36(OUT1) ; also sheet 2
MOTOR5_2 [Power Trace]: MOTOR5_HB.15(OUT2) MOTOR5_HB.16(OUT2) MOTOR5_HB.17(OUT2) MOTOR5_HB.18(OUT2) MOTOR5_HB.19(OUT2) MOTOR5_HB.20(OUT2) MOTOR5_HB.21(OUT2) MOTOR5_HB.22(OUT2) ; also sheet 2
MOTOR5_ENABLE: MOTOR5_HB.27(INH) ; also sheet 1
MOTOR5_POWER [Power Trace]: C80.2 C81.2 MOTOR5_HB.11(VS) MOTOR5_HB.12(VS) MOTOR5_HB.13(VS) MOTOR5_HB.14(VS) MOTOR5_HB.29(VS) MOTOR5_HB.30(VS) MOTOR5_HB.31(VS) MOTOR5_HB.32(VS) ; also sheet 4
MOTOR5_PWM1: MOTOR5_HB.9(IN1) PWM_DRIVER.15(PWM8)
MOTOR5_PWM2: MOTOR5_HB.10(IN2) PWM_DRIVER.16(PWM9)
MOTOR6_1 [Power Trace]: MOTOR6_HB.1(OUT1) MOTOR6_HB.2(OUT1) MOTOR6_HB.3(OUT1) MOTOR6_HB.4(OUT1) MOTOR6_HB.33(OUT1) MOTOR6_HB.34(OUT1) MOTOR6_HB.35(OUT1) MOTOR6_HB.36(OUT1) ; also sheet 2
MOTOR6_2 [Power Trace]: MOTOR6_HB.15(OUT2) MOTOR6_HB.16(OUT2) MOTOR6_HB.17(OUT2) MOTOR6_HB.18(OUT2) MOTOR6_HB.19(OUT2) MOTOR6_HB.20(OUT2) MOTOR6_HB.21(OUT2) MOTOR6_HB.22(OUT2) ; also sheet 2
MOTOR6_ENABLE: MOTOR6_HB.27(INH) ; also sheet 1
MOTOR6_POWER [Power Trace]: C76.2 C77.2 MOTOR6_HB.11(VS) MOTOR6_HB.12(VS) MOTOR6_HB.13(VS) MOTOR6_HB.14(VS) MOTOR6_HB.29(VS) MOTOR6_HB.30(VS) MOTOR6_HB.31(VS) MOTOR6_HB.32(VS) ; also sheet 4
MOTOR6_PWM1: MOTOR6_HB.9(IN1) PWM_DRIVER.17(PWM10)
MOTOR6_PWM2: MOTOR6_HB.10(IN2) PWM_DRIVER.18(PWM11)
MOTOR7_1 [Power Trace]: MOTOR7_HB.1(OUT1) MOTOR7_HB.2(OUT1) MOTOR7_HB.3(OUT1) MOTOR7_HB.4(OUT1) MOTOR7_HB.33(OUT1) MOTOR7_HB.34(OUT1) MOTOR7_HB.35(OUT1) MOTOR7_HB.36(OUT1) ; also sheet 2
MOTOR7_2 [Power Trace]: MOTOR7_HB.15(OUT2) MOTOR7_HB.16(OUT2) MOTOR7_HB.17(OUT2) MOTOR7_HB.18(OUT2) MOTOR7_HB.19(OUT2) MOTOR7_HB.20(OUT2) MOTOR7_HB.21(OUT2) MOTOR7_HB.22(OUT2) ; also sheet 2
MOTOR7_ENABLE: MOTOR7_HB.27(INH) ; also sheet 1
MOTOR7_PWM1: MOTOR7_HB.9(IN1) PWM_DRIVER.19(PWM12)
MOTOR7_PWM2: MOTOR7_HB.10(IN2) PWM_DRIVER.20(PWM13)
MOTOR8_1 [Power Trace]: MOTOR8_HB.1(OUT1) MOTOR8_HB.2(OUT1) MOTOR8_HB.3(OUT1) MOTOR8_HB.4(OUT1) MOTOR8_HB.33(OUT1) MOTOR8_HB.34(OUT1) MOTOR8_HB.35(OUT1) MOTOR8_HB.36(OUT1) ; also sheet 2
MOTOR8_2 [Power Trace]: MOTOR8_HB.15(OUT2) MOTOR8_HB.16(OUT2) MOTOR8_HB.17(OUT2) MOTOR8_HB.18(OUT2) MOTOR8_HB.19(OUT2) MOTOR8_HB.20(OUT2) MOTOR8_HB.21(OUT2) MOTOR8_HB.22(OUT2) ; also sheet 2
MOTOR8_ENABLE: MOTOR8_HB.27(INH) ; also sheet 1
MOTOR8_PWM1: MOTOR8_HB.9(IN1) PWM_DRIVER.21(PWM14)
MOTOR8_PWM2: MOTOR8_HB.10(IN2) PWM_DRIVER.22(PWM15)
N$5: MOTOR4_HB.28(IS) R18.2
N$6: MOTOR1_HB.28(IS) R20.2
N$44: MOTOR6_HB.28(IS) R60.2
N$46: MOTOR3_HB.28(IS) R67.2
N$47: MOTOR8_HB.28(IS) R50.2
N$49: MOTOR7_HB.28(IS) R49.2
N$50: MOTOR5_HB.28(IS) R68.2
N$51: MOTOR2_HB.28(IS) R69.2
PWM_DRIVER_SCL: PWM_DRIVER.26(SCL) SCL_PULLUP.2 ; also sheet 1
PWM_DRIVER_SDA: PWM_DRIVER.27(SDA) SDA_PULLUP.2 ; also sheet 1
PWM_OUTPUT_ENABLE: OE_PULLUP.2 PWM_DRIVER.23(#OE) ; also sheet 1

### Notes on the sheet
- PWM Driver | H-Bridges

## Sheet 4 of 4: Power
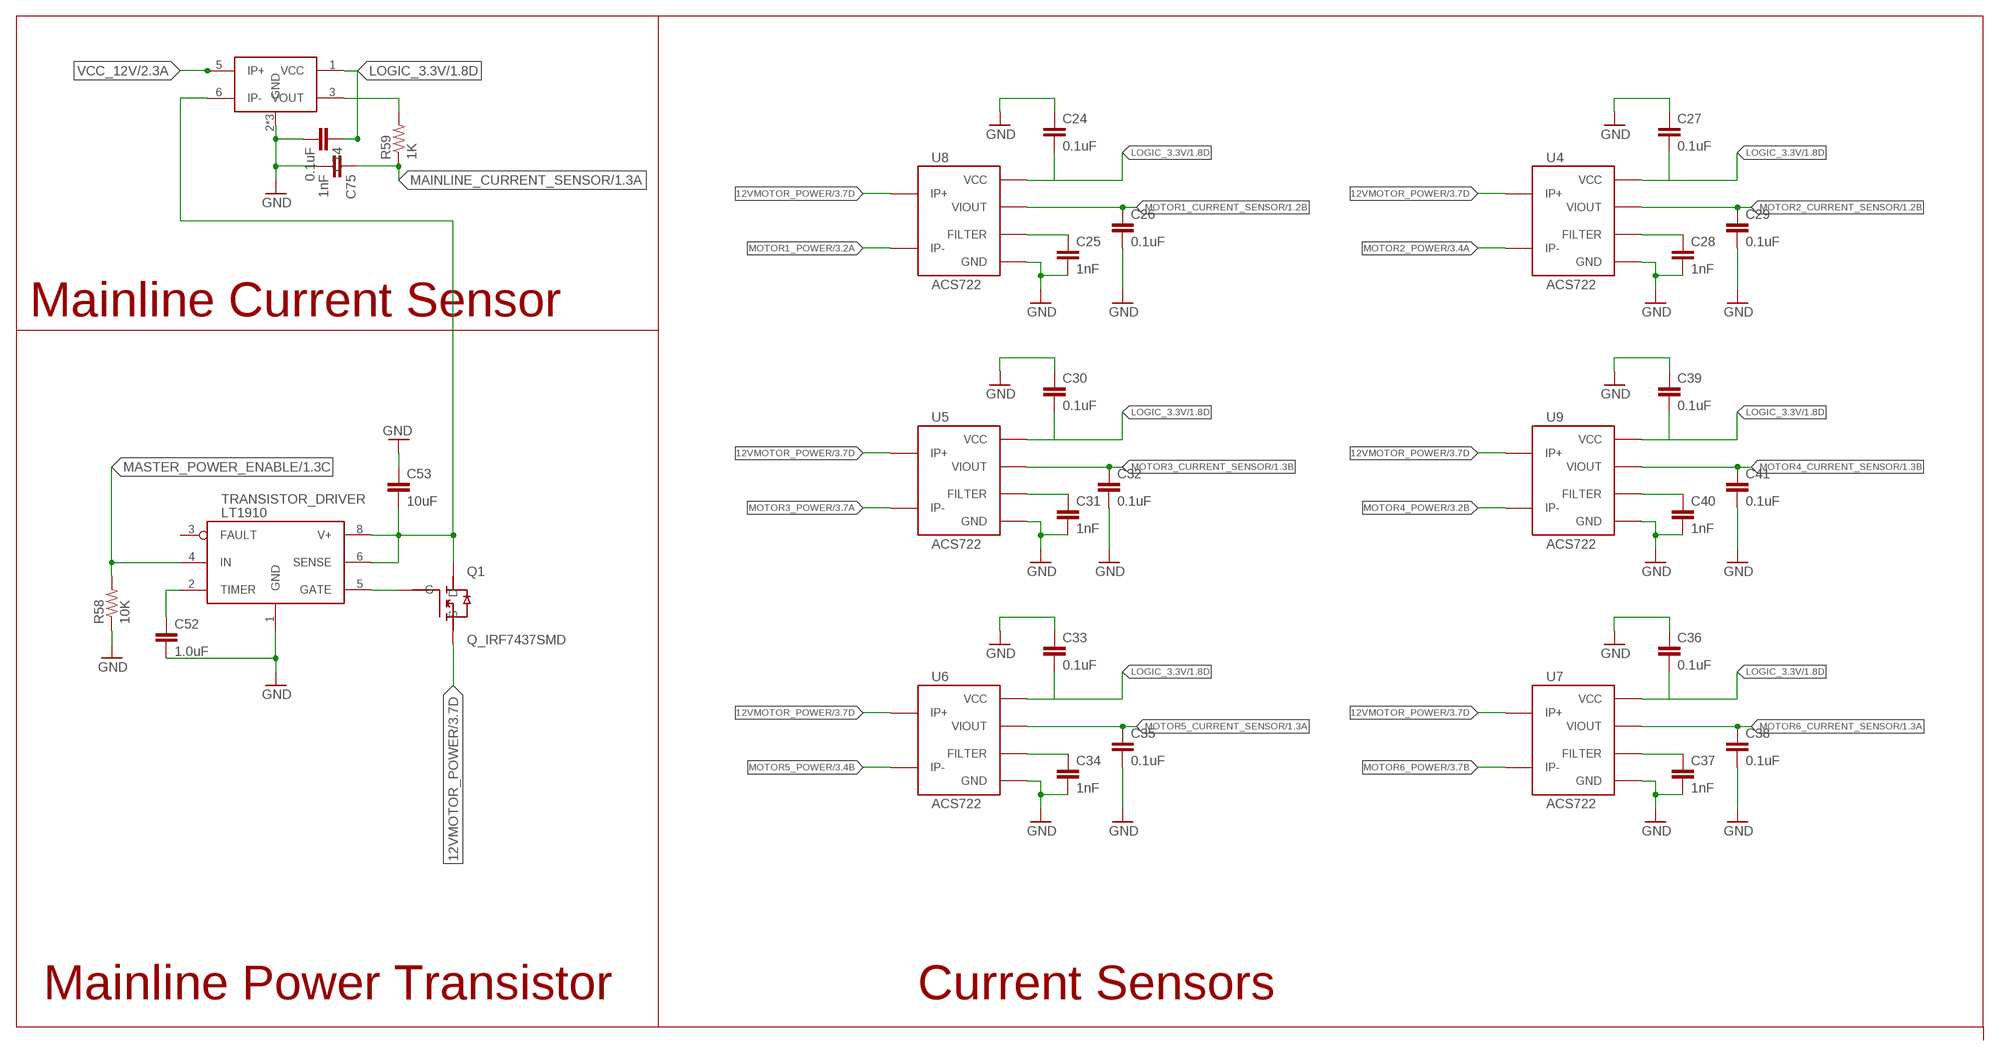
[diagram p3: schematic, sheet 4]

### Parts
C24  0.1uF  CAP0603-CAP  [0603-CAP]
C25  1nF  CAP0603-CAP  [0603-CAP]
C26  0.1uF  CAP0603-CAP  [0603-CAP]
C27  0.1uF  CAP0603-CAP  [0603-CAP]
C28  1nF  CAP0603-CAP  [0603-CAP]
C29  0.1uF  CAP0603-CAP  [0603-CAP]
C30  0.1uF  CAP0603-CAP  [0603-CAP]
C31  1nF  CAP0603-CAP  [0603-CAP]
C32  0.1uF  CAP0603-CAP  [0603-CAP]
C33  0.1uF  CAP0603-CAP  [0603-CAP]
C34  1nF  CAP0603-CAP  [0603-CAP]
C35  0.1uF  CAP0603-CAP  [0603-CAP]
C36  0.1uF  CAP0603-CAP  [0603-CAP]
C37  1nF  CAP0603-CAP  [0603-CAP]
C38  0.1uF  CAP0603-CAP  [0603-CAP]
C39  0.1uF  CAP0603-CAP  [0603-CAP]
C40  1nF  CAP0603-CAP  [0603-CAP]
C41  0.1uF  CAP0603-CAP  [0603-CAP]
C52  1.0uF  CAP0603-CAP  [0603-CAP]
C53  10uF  CAP0603-CAP  [0603-CAP]
C74  0.1uF  CAP0603-CAP  [0603-CAP]
C75  1nF  CAP0603-CAP  [0603-CAP]
MAINLINE_CURRENT  ACS781  [7-POWER_SMD_MODULE]
Q1  Q_IRF7437SMD  [D2PACK]
R58  10K  RESISTOR0402-RES  [0402-RES]
R59  1K  RESISTOR0402-RES  [0402-RES]
TRANSISTOR_DRIVER  LT1910  [SO8]
U4  ACS722  [SOIC8]
U5  ACS722  [SOIC8]
U6  ACS722  [SOIC8]
U7  ACS722  [SOIC8]
U8  ACS722  [SOIC8]
U9  ACS722  [SOIC8]

### Nets
12VMOTOR_POWER [Power Trace]: Q1.2(S) U4.1(IP+) U4.2(IP+) U5.1(IP+) U5.2(IP+) U6.1(IP+) U6.2(IP+) U7.1(IP+) U7.2(IP+) U8.1(IP+) U8.2(IP+) U9.1(IP+) U9.2(IP+) ; also sheet 3
GND: C24.1 C25.2 C26.2 C27.1 C28.2 C29.2 C30.1 C31.2 C32.2 C33.1 C34.2 C35.2 C36.1 C37.2 C38.2 C39.1 C40.2 C41.2 C52.2 C53.1 C74.2 C75.2 MAINLINE_CURRENT.2(GND) MAINLINE_CURRENT.4(GND) MAINLINE_CURRENT.7(GND) R58.1 TRANSISTOR_DRIVER.1(GND) U4.5(GND) U5.5(GND) U6.5(GND) U7.5(GND) U8.5(GND) U9.5(GND) ; also sheet 1,2,3
LOGIC_3.3V: C24.2 C27.2 C30.2 C33.2 C36.2 C39.2 C74.1 MAINLINE_CURRENT.1(VCC) U4.8(VCC) U5.8(VCC) U6.8(VCC) U7.8(VCC) U8.8(VCC) U9.8(VCC) ; also sheet 1,2,3
MAINLINE_CURRENT_SENSOR: C75.1 R59.1 ; also sheet 1
MASTER_POWER_ENABLE: R58.2 TRANSISTOR_DRIVER.4(IN) ; also sheet 1
MOTOR1_CURRENT_SENSOR: C26.1 U8.7(VIOUT) ; also sheet 1
MOTOR1_POWER [Power Trace]: U8.3(IP-) U8.4(IP-) ; also sheet 3
MOTOR2_CURRENT_SENSOR: C29.1 U4.7(VIOUT) ; also sheet 1
MOTOR2_POWER [Power Trace]: U4.3(IP-) U4.4(IP-) ; also sheet 3
MOTOR3_CURRENT_SENSOR: C32.1 U5.7(VIOUT) ; also sheet 1
MOTOR3_POWER [Power Trace]: U5.3(IP-) U5.4(IP-) ; also sheet 3
MOTOR4_CURRENT_SENSOR: C41.1 U9.7(VIOUT) ; also sheet 1
MOTOR4_POWER [Power Trace]: U9.3(IP-) U9.4(IP-) ; also sheet 3
MOTOR5_CURRENT_SENSOR: C35.1 U6.7(VIOUT) ; also sheet 1
MOTOR5_POWER [Power Trace]: U6.3(IP-) U6.4(IP-) ; also sheet 3
MOTOR6_CURRENT_SENSOR: C38.1 U7.7(VIOUT) ; also sheet 1
MOTOR6_POWER [Power Trace]: U7.3(IP-) U7.4(IP-) ; also sheet 3
N$7: C28.1 U4.6(FILTER)
N$9: C52.1 TRANSISTOR_DRIVER.2(TIMER)
N$11: C25.1 U8.6(FILTER)
N$12: C31.1 U5.6(FILTER)
N$15: C34.1 U6.6(FILTER)
N$17: C37.1 U7.6(FILTER)
N$19: C40.1 U9.6(FILTER)
N$45: Q1.1(G) TRANSISTOR_DRIVER.5(GATE)
N$48: C53.2 MAINLINE_CURRENT.6(IP-) Q1.TAB(D) TRANSISTOR_DRIVER.6(SENSE) TRANSISTOR_DRIVER.8(V+)
N$100: MAINLINE_CURRENT.3(VOUT) R59.2
VCC_12V: MAINLINE_CURRENT.5(IP+) ; also sheet 2
Unconnected: TRANSISTOR_DRIVER.3(FAULT)

### Notes on the sheet
- Mainline Current Sensor
- Mainline Power Transistor | Current Sensors

## Library data of the parts
3.3V LED1 LED2 = led:LED: LED OSRAM: - CHIPLED LG R971, LG N971, LY N971, LG Q971, LY Q971, LO R971, LY R971 LH N974, LH R974 LS Q976, LO Q976, LY Q976 LO Q996 - Hyper CHIPLED LW Q18S LB Q993, LB Q99A, LB R99A - SideLED LS A670, LO A670, LY A670, LG A670, LP A670 LB A673, LV A673, LT A673, LW A673 LH A674 LY A675 LS A676, LA A676, LO A676, LY A676, LW A676 LS A679, LY A679, LG A679 - Hyper Micro SIDELED® LS Y876, LA Y876, LO Y876, LY Y876 LT Y87S - SmartLED LW L88C, LW L88S LB L89C, LB L89S, LG L890 LS L89K, LO L89K, LY L89K LS L896, LA L896, LO L896, LY L896 - TOPLED LS T670, LO T670, LY T670, LG T670, LP T670 LSG T670, LSP T670, LSY T670, LOP T670, LYG T670 LG T671, LOG T671, LSG T671 LB T673, LV T673, LT T673, LW T673 LH T674 LS T676, LA T676, LO T676, LY T676, LB T676, LH T676, LSB T676, LW T676 LB T67C, LV T67C, LT T67C, LS T67K, LO T67K, LY T67K, LW E67C LS E67B, LA E67B, LO E67B, LY E67B, LB E67C, LV E67C, LT E67C LW T67C LS T679, LY T679, LG T679 LS T770, LO T770, LY T770, LG T770, LP T770 LB T773, LV T773, LT T773, LW T773 LH T774 LS E675, LA E675, LY E675, LS T675 LS T776, LA T776, LO T776, LY T776, LB T776 LHGB T686 LT T68C, LB T68C - Hyper Mini TOPLED® LB M676 - Mini TOPLED Santana® LG M470 LS M47K, LO M47K, LY M47K Source: http://www.osram.convergy.de LUXEON: - LUMILED® LXK2-PW12-R00, LXK2-PW12-S00, LXK2-PW14-U00, LXK2-PW14-V00 LXK2-PM12-R00, LXK2-PM12-S00, LXK2-PM14-U00 LXK2-PE12-Q00, LXK2-PE12-R00, LXK2-PE12-S00, LXK2-PE14-T00, LXK2-PE14-U00 LXK2-PB12-K00, LXK2-PB12-L00, LXK2-PB12-M00, LXK2-PB14-N00, LXK2-PB14-P00, LXK2-PB14-Q00 LXK2-PR12-L00, LXK2-PR12-M00, LXK2-PR14-Q00, LXK2-PR14-R00 LXK2-PD12-Q00, LXK2-PD12-R00, LXK2-PD12-S00 LXK2-PH12-R00, LXK2-PH12-S00 LXK2-PL12-P00, LXK2-PL12-Q00, LXK2-PL12-R00 Source: www.luxeon.com KINGBRIGHT: KA-3528ASYC Source: www.kingbright.com
3.3V_DCDC_OKI = MRDT-2014-All:Q_OKI-78SR: Fixed Output 1-5 AMP SIP DC/DC converter(can be 5V or 3.3V)
12V_LOGIC_IN GND GROUND POWER_12V POWER_12V2 = MRDT-Connectors:APP: http://www.powerwerx.com/anderson-powerpoles/
C1-C19 = resistor:C-US: CAPACITOR, American symbol
C20-C41 C44-C47 C50 C52 C53 C61 C62 C74-C83 = SparkFun-Passives:CAP: Capacitor Standard 0603 ceramic capacitor, and 0.1" leaded capacitor.
D1-D6 = MRDT-EAGLE-Training:LED: LEDs Standard schematic elements and footprints for 5mm, 3mm, 1206, and 0603 sized LEDs. 5mm - Spark Fun Electronics SKU : COM-00529 (and others)
ENCODER1-ENCODER6 = MRDT-Connectors:ENCODER
FAN LIMIT_SWITCH_1-LIMIT_SWITCH_3 = MRDT-Connectors:SL02
J1 = MRDT-Connectors:RJ45
J2 = MRDT-Connectors:JTAG_ARM_10PIN; PARTNO: M50-3600542
MAINLINE_CURRENT = MRDT-ICs:ACS781: ACS781 Current Sensor
MOTOR1-MOTOR8 = MRDT-Connectors:APP_2POS_CONFIG
MOTOR1_HB MOTOR2_HB MOTOR3_HB MOTOR4_HB MOTOR5_HB MOTOR6_HB MOTOR7_HB MOTOR8_HB = MRDT-ICs:BTM7752G: 12V 10A H-Bridge
OE_PULLUP R18 R20 R49-R69 SCL_PULLUP SDA_PULLUP = SparkFun-Passives:RESISTOR: Resistor Basic schematic elements and footprints for 0603, 1206, and PTH resistors.
PWM_DRIVER = adafruit:PCA9685: PCA9685 - 16 Channel 12-Bit I2C PWM Controller 5.0V tolerant 16 channel, 12-bit I2C PWM controller with 25mA per output (max. 400mA total) Digikey: 568-5931-1-ND
Q1 = MRDT-2015-PowerBoard:Q_IRF*7437: 40V 195A N-CH MOSFET switch with heatsink
R1 = rcl:R-US_: RESISTOR, American symbol
R2-R17 R19 = resistor:R-US_: RESISTOR, American symbol
S1 = MRDT-UserInput:SWITCH_TACTILE
S2-S4 = MRDT-UserInput:PUSHBUTTON; PARTNO: MJTP1243
S5 = MRDT-UserInput:SWITCH-SPDT; PARTNO: SS12D07VG4NSGAPA
TRANSISTOR_DRIVER = MRDT-2015-PowerBoard:LT1910
U1 = MRDT-Microcontrollers:TM4C1294NCPDT
U2 = MRDT-ICs:HX1198FNL
U3 = MRDT-ICs:SLVU2.8-4
U4-U9 = MRDT-ICs:ACS722; PARTNO: ACS722
U$1 = MRDT-Hardware:MRDT_LOGO
U$2-U$4 = MRDT-Hardware:MOUNTING_HOLE: Mounting hole for M6 bolt. Standard use mounting hole for: Tiva C Connected - M6 Anderson Powerpole Mounting Wing - M8 Most frame-mounted PCB's - M8
Y1 = MRDT-Passives:NX3225GA
Y2 = MRDT-Passives:CRYATL_32K_SMD

## Net classes
2 Ethernet: width 0.22 mm, clearance 0.152 mm
3 Power Trace: width 1.829 mm, clearance 0.406 mm